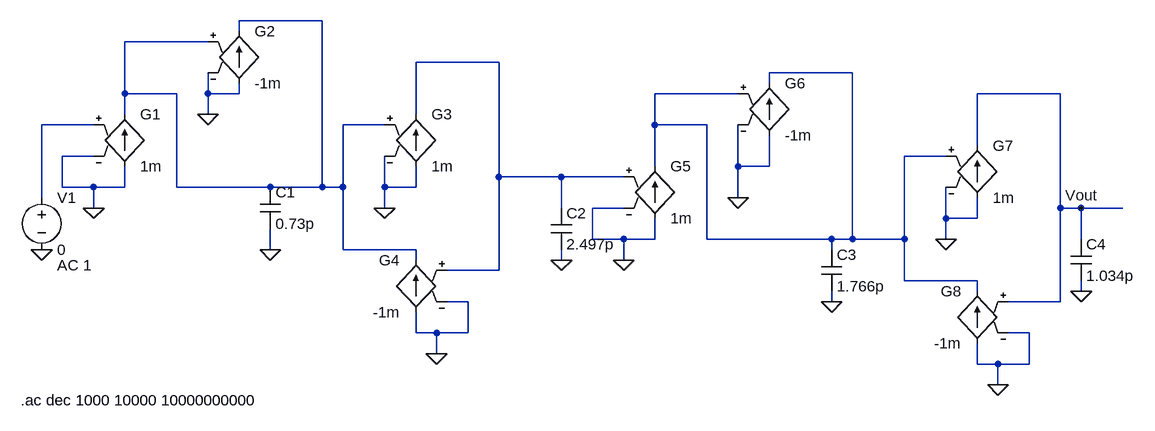
[diagram p0: schematic ideal_gm_filter.asc]
ideal_gm_filter.asc, the LTspice schematic file:
Version 4
SHEET 1 1700 680
WIRE 352 -32 224 -32
WIRE 224 -16 224 -32
WIRE 176 0 48 0
WIRE 624 32 496 32
WIRE 1168 48 1040 48
WIRE 1040 64 1040 48
WIRE 48 80 48 0
WIRE 128 80 48 80
WIRE 176 80 176 48
WIRE 224 80 224 64
WIRE 224 80 176 80
WIRE 992 80 864 80
WIRE 1488 80 1360 80
WIRE 48 112 48 80
WIRE 176 112 176 80
WIRE 496 112 496 32
WIRE 0 128 -80 128
WIRE 448 128 384 128
WIRE 864 128 864 80
WIRE 944 128 864 128
WIRE 1360 160 1360 80
WIRE 0 176 -48 176
WIRE 1312 176 1248 176
WIRE 864 192 864 128
WIRE 992 192 992 128
WIRE 1040 192 1040 144
WIRE 1040 192 992 192
WIRE 624 208 624 32
WIRE 720 208 624 208
WIRE 816 208 720 208
WIRE -48 224 -48 176
WIRE 0 224 -48 224
WIRE 48 224 48 192
WIRE 48 224 0 224
WIRE 128 224 128 80
WIRE 272 224 128 224
WIRE 352 224 352 -32
WIRE 352 224 272 224
WIRE 384 224 384 128
WIRE 384 224 352 224
WIRE 448 224 448 176
WIRE 496 224 496 192
WIRE 496 224 448 224
WIRE -80 240 -80 128
WIRE 992 240 992 192
WIRE 0 256 0 224
WIRE 448 256 448 224
WIRE 720 256 720 208
WIRE 816 256 768 256
WIRE 1488 256 1488 80
WIRE 1520 256 1488 256
WIRE 1584 256 1520 256
WIRE 1312 272 1312 224
WIRE 1360 272 1360 240
WIRE 1360 272 1312 272
WIRE 768 304 768 256
WIRE 816 304 768 304
WIRE 864 304 864 272
WIRE 864 304 816 304
WIRE 944 304 944 128
WIRE 1136 304 944 304
WIRE 1168 304 1168 48
WIRE 1168 304 1136 304
WIRE 1248 304 1248 176
WIRE 1248 304 1168 304
WIRE 1312 304 1312 272
WIRE 1520 304 1520 256
WIRE 272 320 272 288
WIRE 384 320 384 224
WIRE 496 320 384 320
WIRE 1136 320 1136 304
WIRE 496 336 496 320
WIRE 720 336 720 320
WIRE 816 336 816 304
WIRE 624 352 624 208
WIRE 624 352 544 352
WIRE 1248 368 1248 304
WIRE 1360 368 1248 368
WIRE 1360 384 1360 368
WIRE 1520 384 1520 368
WIRE 576 400 544 400
WIRE 1136 400 1136 384
WIRE 1488 400 1488 256
WIRE 1488 400 1408 400
WIRE 496 448 496 416
WIRE 528 448 496 448
WIRE 576 448 576 400
WIRE 576 448 528 448
WIRE 1440 448 1408 448
WIRE 528 480 528 448
WIRE 1360 496 1360 464
WIRE 1392 496 1360 496
WIRE 1440 496 1440 448
WIRE 1440 496 1392 496
WIRE 1392 528 1392 496
FLAG 0 256 0
FLAG -80 320 0
FLAG 272 320 0
FLAG 448 256 0
FLAG 528 480 0
FLAG 816 336 0
FLAG 1136 400 0
FLAG 1312 304 0
FLAG 1392 528 0
FLAG 720 336 0
FLAG 1520 384 0
FLAG 1520 256 Vout
FLAG 176 112 0
FLAG 992 240 0
SYMBOL g 48 96 R0
SYMATTR InstName G1
SYMATTR Value 1m
SYMBOL voltage -80 224 R0
WINDOW 123 24 120 Left 2
WINDOW 39 0 0 Left 0
SYMATTR Value2 AC 1
SYMATTR InstName V1
SYMATTR Value 0
SYMBOL cap 256 224 R0
SYMATTR InstName C1
SYMATTR Value 0.73p
SYMBOL g 224 -32 R0
SYMATTR InstName G2
SYMATTR Value -1m
SYMBOL g 496 96 R0
SYMATTR InstName G3
SYMATTR Value 1m
SYMBOL g 496 320 M0
SYMATTR InstName G4
SYMATTR Value -1m
SYMBOL cap 704 256 R0
SYMATTR InstName C2
SYMATTR Value 2.497p
SYMBOL g 864 176 R0
SYMATTR InstName G5
SYMATTR Value 1m
SYMBOL cap 1120 320 R0
SYMATTR InstName C3
SYMATTR Value 1.766p
SYMBOL g 1040 48 R0
SYMATTR InstName G6
SYMATTR Value -1m
SYMBOL g 1360 144 R0
SYMATTR InstName G7
SYMATTR Value 1m
SYMBOL g 1360 368 M0
SYMATTR InstName G8
SYMATTR Value -1m
SYMBOL cap 1504 304 R0
SYMATTR InstName C4
SYMATTR Value 1.034p
TEXT -112 552 Left 2 !.ac dec 1000 10000 10000000000

The netlist it stands for:
* ideal_gm_filter.asc
G1 0 N001 N004 0 1m
V1 N004 0 0 AC 1
C1 N001 0 0.73p
G2 0 N001 N001 0 -1m
G3 0 N002 N001 0 1m
G4 0 N001 N002 0 -1m
C2 N002 0 2.497p
G5 0 N003 N002 0 1m
C3 N003 0 1.766p
G6 0 N003 N003 0 -1m
G7 0 Vout N003 0 1m
G8 0 N003 Vout 0 -1m
C4 Vout 0 1.034p
.ac dec 1000 10000 10000000000
.backanno
.end